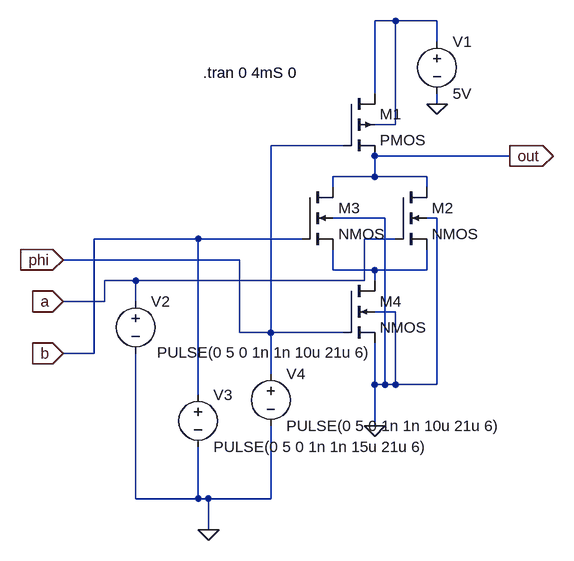
[diagram p0: schematic dynamic_NOR.asc]
dynamic_NOR.asc, the LTspice schematic file:
Version 4
SHEET 1 880 852
WIRE 320 48 288 48
WIRE 384 48 320 48
WIRE 384 80 384 48
WIRE 288 160 288 48
WIRE 384 176 384 160
WIRE 320 208 320 48
WIRE 320 208 288 208
WIRE 240 240 128 240
WIRE 496 256 288 256
WIRE 288 288 288 256
WIRE 288 288 224 288
WIRE 368 288 288 288
WIRE 224 304 224 288
WIRE 368 304 368 288
WIRE 304 352 224 352
WIRE 384 352 368 352
WIRE 16 384 -144 384
WIRE 176 384 16 384
WIRE 320 384 272 384
WIRE 80 416 -192 416
WIRE 224 432 224 400
WIRE 288 432 224 432
WIRE 368 432 368 400
WIRE 368 432 288 432
WIRE -80 448 -128 448
WIRE 272 448 272 384
WIRE 272 448 -80 448
WIRE 288 448 288 432
WIRE -128 480 -128 448
WIRE -128 480 -192 480
WIRE -80 480 -80 448
WIRE 320 496 288 496
WIRE 80 528 80 416
WIRE 128 528 128 240
WIRE 128 528 80 528
WIRE 240 528 128 528
WIRE -144 560 -144 384
WIRE -144 560 -192 560
WIRE 128 592 128 528
WIRE 288 608 288 544
WIRE 304 608 304 352
WIRE 304 608 288 608
WIRE 320 608 320 496
WIRE 320 608 304 608
WIRE 384 608 384 352
WIRE 384 608 320 608
WIRE 16 624 16 384
WIRE 288 672 288 608
WIRE -80 784 -80 560
WIRE 16 784 16 704
WIRE 16 784 -80 784
WIRE 32 784 16 784
WIRE 128 784 128 672
WIRE 128 784 32 784
WIRE 32 832 32 784
FLAG 288 672 0
FLAG 384 176 0
FLAG -192 416 phi
IOPIN -192 416 In
FLAG -192 480 a
IOPIN -192 480 In
FLAG -192 560 b
IOPIN -192 560 In
FLAG 496 256 out
IOPIN 496 256 Out
FLAG 32 832 0
SYMBOL pmos4 240 160 R0
SYMATTR InstName M1
SYMBOL nmos4 320 304 R0
SYMATTR InstName M2
SYMBOL nmos4 176 304 R0
SYMATTR InstName M3
SYMBOL nmos4 240 448 R0
SYMATTR InstName M4
SYMBOL voltage 384 64 R0
WINDOW 123 0 0 Left 0
WINDOW 39 0 0 Left 0
SYMATTR InstName V1
SYMATTR Value 5V
SYMBOL voltage -80 464 R0
WINDOW 123 0 0 Left 0
WINDOW 39 0 0 Left 0
WINDOW 3 198 110 Bottom 2
SYMATTR InstName V2
SYMATTR Value PULSE(0 5 0 1n 1n 10u 21u 6)
SYMBOL voltage 16 608 R0
WINDOW 123 0 0 Left 0
WINDOW 39 0 0 Left 0
SYMATTR InstName V3
SYMATTR Value PULSE(0 5 0 1n 1n 15u 21u 6)
SYMBOL voltage 128 576 R0
WINDOW 123 0 0 Left 0
WINDOW 39 0 0 Left 0
SYMATTR InstName V4
SYMATTR Value PULSE(0 5 0 1n 1n 10u 21u 6)
TEXT 24 128 Left 2 !.tran 0 4mS 0

The netlist it stands for:
* dynamic_NOR.asc
M1 N001 phi out N001 PMOS
M2 out a N002 0 NMOS
M3 out b N002 0 NMOS
M4 N002 phi 0 0 NMOS
V1 N001 0 5V
V2 a 0 PULSE(0 5 0 1n 1n 10u 21u 6)
V3 b 0 PULSE(0 5 0 1n 1n 15u 21u 6)
V4 phi 0 PULSE(0 5 0 1n 1n 10u 21u 6)
.model NMOS NMOS
.model PMOS PMOS
.lib standard.mos
.tran 0 4mS 0
.backanno
.end